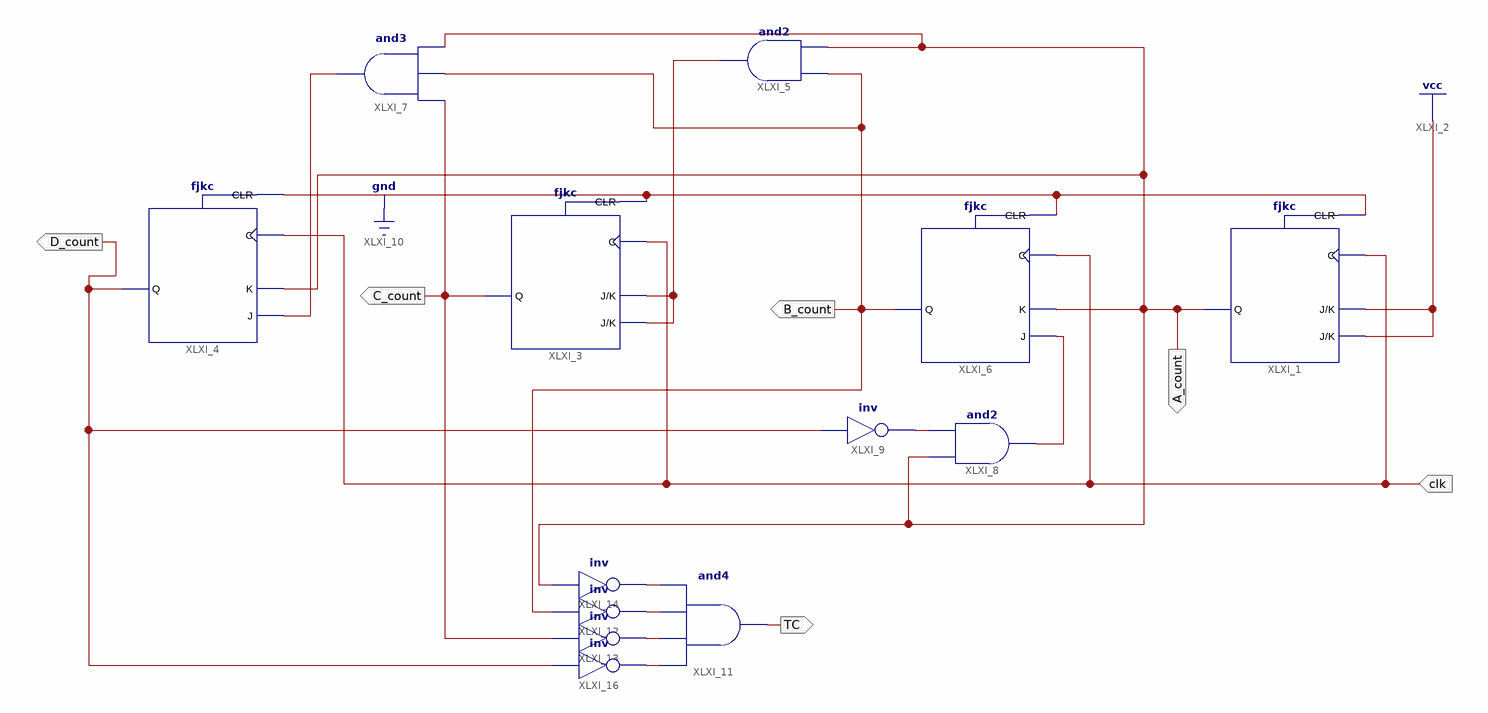
[diagram p0: schematic sheet 1]
// Xilinx ISE schematic couter0_9.sch (spartan6) as structural Verilog: 13 symbols, 6 ports
module couter0_9 (
  input  clk,
  output C_count,
  output B_count,
  output TC,
  output D_count,
  output A_count
);

  wire XLXN_2, XLXN_3, XLXN_9, XLXN_10, XLXN_16, XLXN_17, XLXN_25, XLXN_26;

  fjkc XLXI_1 (.C(clk), .CLR(1'b0), .J(1'b1), .K(1'b1), .Q(A_count));
  fjkc XLXI_3 (.C(clk), .CLR(1'b0), .J(XLXN_2), .K(XLXN_2), .Q(C_count));
  fjkc XLXI_4 (.C(clk), .CLR(1'b0), .J(XLXN_3), .K(A_count), .Q(D_count));
  and XLXI_5 (XLXN_2, A_count, B_count);
  fjkc XLXI_6 (.C(clk), .CLR(1'b0), .J(XLXN_9), .K(A_count), .Q(B_count));
  and XLXI_7 (XLXN_3, A_count, B_count, C_count);
  and XLXI_8 (XLXN_9, A_count, XLXN_10);
  not XLXI_9 (XLXN_10, D_count);
  and XLXI_11 (TC, XLXN_26, XLXN_17, XLXN_16, XLXN_25);
  not XLXI_12 (XLXN_16, B_count);
  not XLXI_13 (XLXN_17, C_count);
  not XLXI_14 (XLXN_25, A_count);
  not XLXI_16 (XLXN_26, D_count);
endmodule
